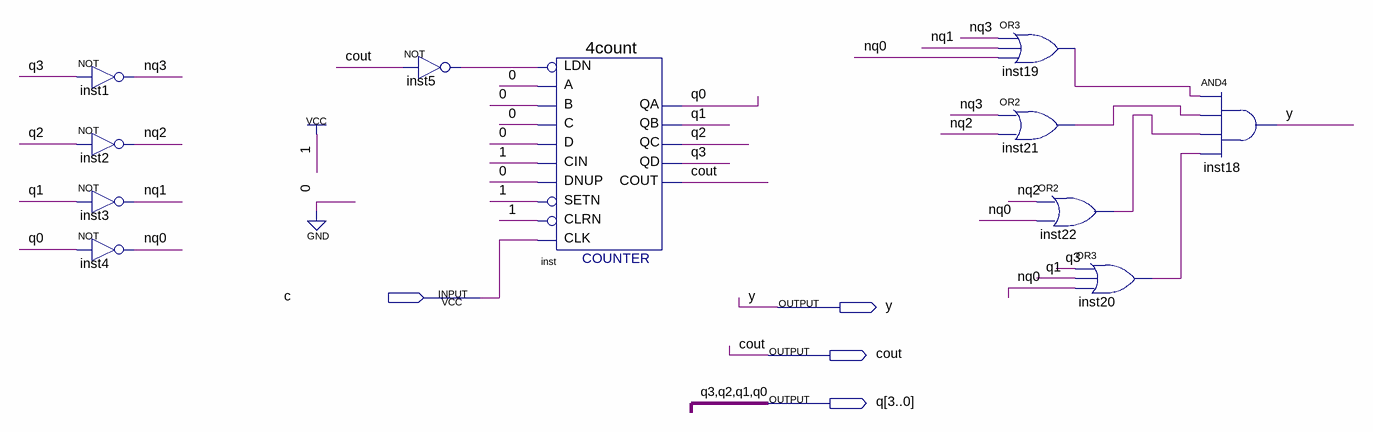
[diagram p0: schematic sheet]
// Quartus schematic s82.bdf as structural Verilog: 11 symbols, 4 pins
module s82 (
  input  c,
  output y,
  output cout,
  output [3:0] q
);

  wire inst5_out, inst19_out, inst20_out, inst21_out, inst22_out, nq0, nq1, nq2, nq3;

  not inst1 (nq3, q[3]);
  not inst2 (nq2, q[2]);
  not inst3 (nq1, q[1]);
  not inst4 (nq0, q[0]);
  not inst5 (inst5_out, cout);
  \4count  inst (
    .LDN(inst5_out), .B(1'b0), .A(1'b0), .D(1'b0), .CIN(1'b1), .DNUP(1'b0), .CLK(c), .SETN(1'b1), .C(1'b0),
    .CLRN(1'b1), .QA(q[0]), .QB(q[1]), .QC(q[2]), .QD(q[3]), .COUT(cout));
  or inst19 (inst19_out, nq3, nq1, nq0);
  or inst21 (inst21_out, nq3, nq2);
  or inst22 (inst22_out, nq2, nq0);
  or inst20 (inst20_out, q[3], q[1], nq0);
  and inst18 (y, inst19_out, inst21_out, inst22_out, inst20_out);
endmodule
